# EAGLE design B171X (EAGLE 6.6.0)
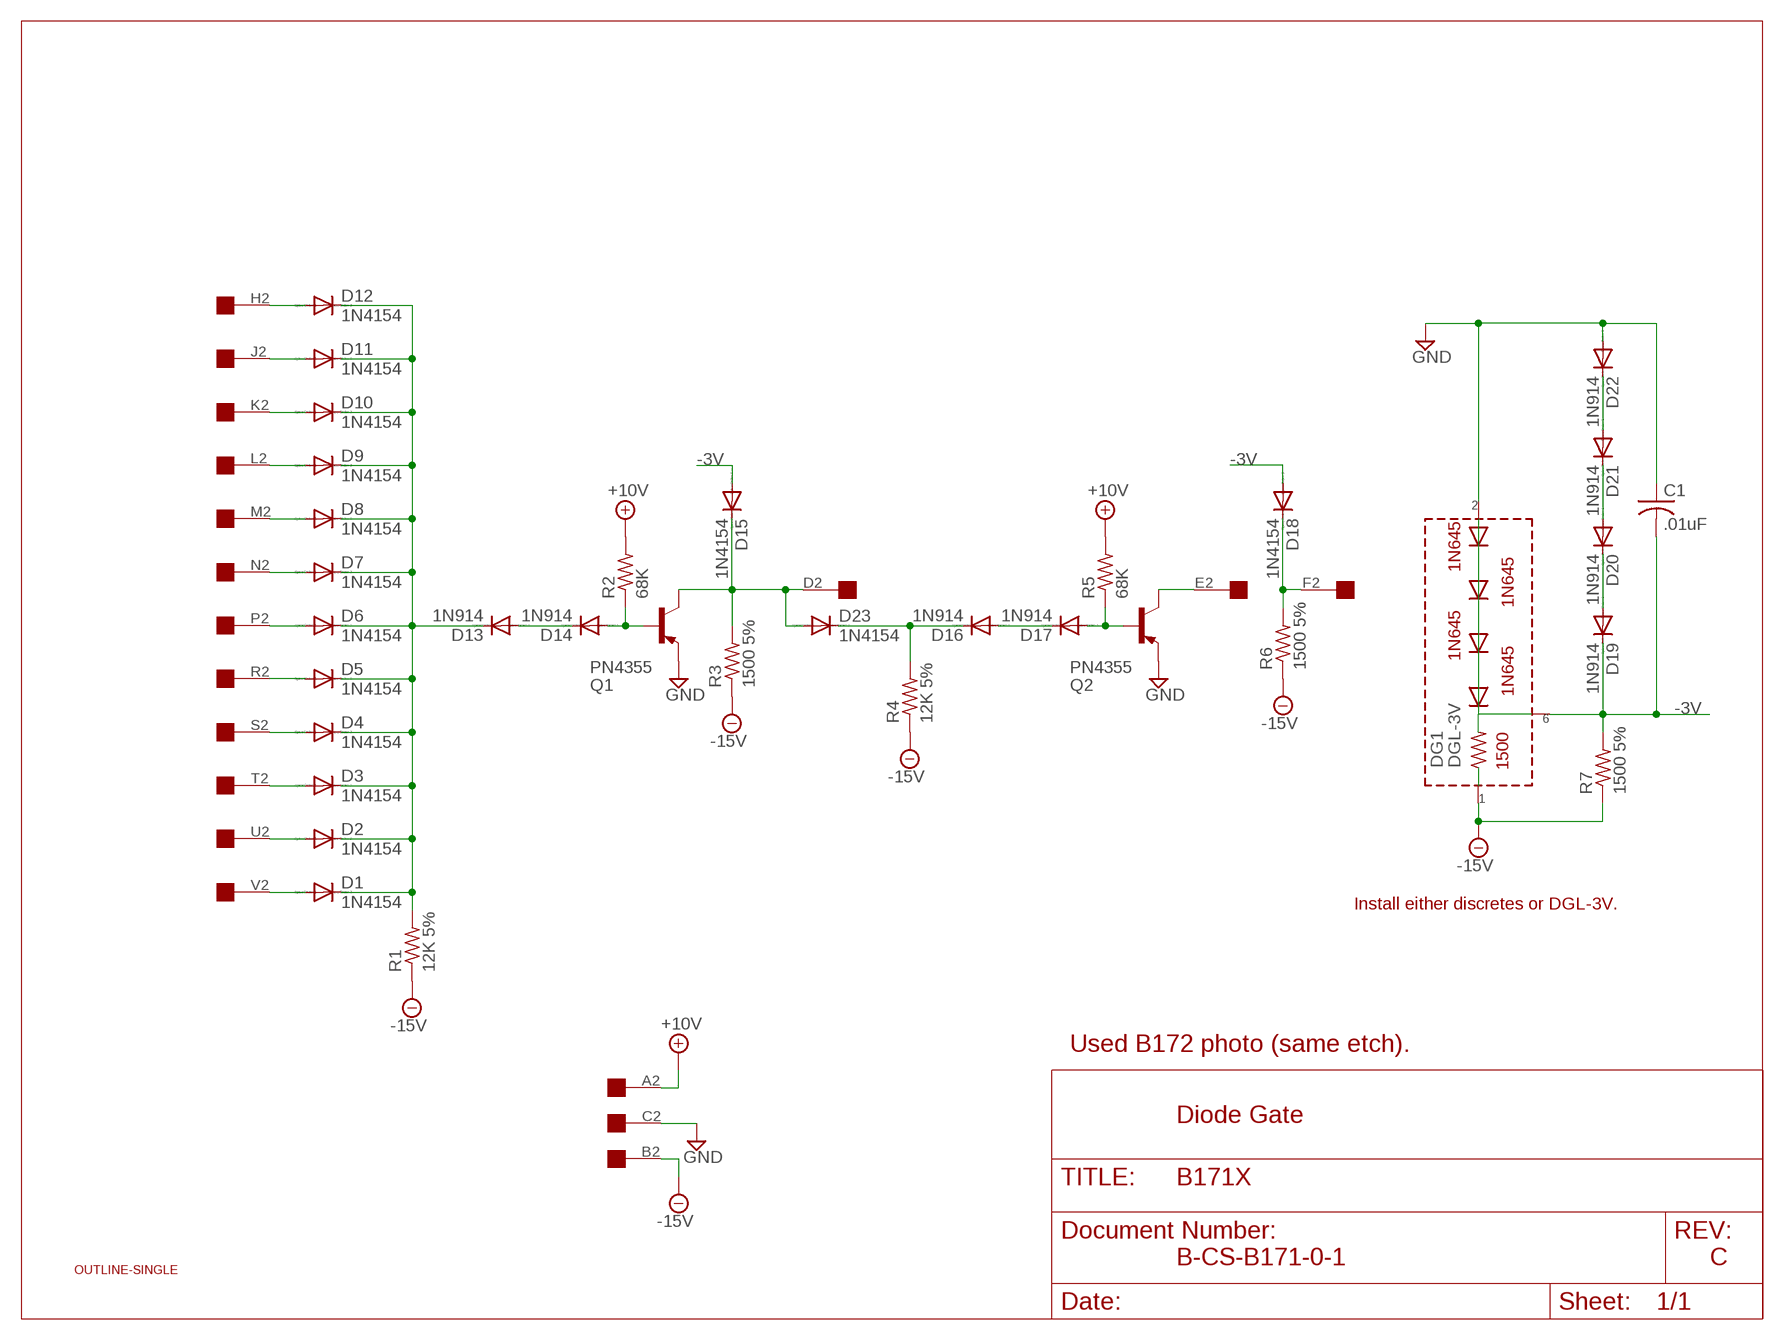
[diagram p0: schematic, sheet 1]

## Parts
C1  .01uF  C-US050-025X075  [C050-025X075]
D1  1N4154  DIODE-DO35-10  [DO35-10]
D2  1N4154  DIODE-DO35-10  [DO35-10]
D3  1N4154  DIODE-DO35-10  [DO35-10]
D4  1N4154  DIODE-DO35-10  [DO35-10]
D5  1N4154  DIODE-DO35-10  [DO35-10]
D6  1N4154  DIODE-DO35-10  [DO35-10]
D7  1N4154  DIODE-DO35-10  [DO35-10]
D8  1N4154  DIODE-DO35-10  [DO35-10]
D9  1N4154  DIODE-DO35-10  [DO35-10]
D10  1N4154  DIODE-DO35-10  [DO35-10]
D11  1N4154  DIODE-DO35-10  [DO35-10]
D12  1N4154  DIODE-DO35-10  [DO35-10]
D13  1N914  DIODE-DO35-10  [DO35-10]
D14  1N914  DIODE-DO35-10  [DO35-10]
D15  1N4154  DIODE-DO35-10  [DO35-10]
D16  1N914  DIODE-DO35-10  [DO35-10]
D17  1N914  DIODE-DO35-10  [DO35-10]
D18  1N4154  DIODE-DO35-10  [DO35-10]
D19  1N914  DIODE-DO35-10  [DO35-10]
D20  1N914  DIODE-DO35-10  [DO35-10]
D21  1N914  DIODE-DO35-10  [DO35-10]
D22  1N914  DIODE-DO35-10  [DO35-10]
D23  1N4154  DIODE-DO35-10  [DO35-10]
DG1  DGL-3V  [DGL2]
Q1  PN4355  -PNP-TO5  [TO5]
Q2  PN4355  -PNP-TO5  [TO5]
R1  12K 5%  R-US_0207/10  [0207/10]
R2  68K  R-US_0207/10  [0207/10]
R3  1500 5%  R-US_0207/10  [0207/10]
R4  12K 5%  R-US_0207/10  [0207/10]
R5  68K  R-US_0207/10  [0207/10]
R6  1500 5%  R-US_0207/10  [0207/10]
R7  1500 5%  R-US_0207/10  [0207/10]
U$1  OUTLINE-SINGLE  [SINGLE]
U$2  EDGE-1  [EDGE-CON1]

## Nets
+10V: R2.2 R5.2 U$2.A2
-3V: C1.2 D15.A D18.A D19.C DG1.P$6 R7.2
-15V: DG1.P$1 R1.1 R3.1 R4.1 R6.1 R7.1 U$2.B2
D: D15.C D23.A Q1.3(C) R3.2 U$2.D2
E: Q2.3(C) U$2.E2
GND: C1.1 D22.A DG1.P$2 Q1.1(E) Q2.1(E) U$2.C2
H: D12.A U$2.H2
J: D11.A U$2.J2
K: D10.A U$2.K2
L: D9.A U$2.L2
M: D8.A U$2.M2
N: D7.A U$2.N2
N$1: D1.C D2.C D3.C D4.C D5.C D6.C D7.C D8.C D9.C D10.C D11.C D12.C D13.C R1.2
N$2: D13.A D14.C
N$3: D14.A Q1.2(B) R2.1
N$4: D16.C D23.C R4.2
N$5: D16.A D17.C
N$6: D17.A Q2.2(B) R5.1
N$7: D18.C R6.2 U$2.F2
N$10: D19.A D20.C
N$11: D20.A D21.C
N$12: D21.A D22.C
P: D6.A U$2.P2
R: D5.A U$2.R2
S: D4.A U$2.S2
T: D3.A U$2.T2
U: D2.A U$2.U2
V: D1.A U$2.V2

## Notes on the sheet
- Install either discretes or DGL-3V.
- Used B172 photo (same etch).
- Diode Gate
- B-CS-B171-0-1 | C

## Library data of the parts
C1 = rcl:C-US: CAPACITOR, American symbol
D1-D23 = diode:DIODE-: DIODE
DG1 = dec-con:DGL-3V: -3V Clamp/Reference
Q1 Q2 = transistor:*-PNP-: PNP Transistror
R1-R7 = rcl:R-US_: RESISTOR, American symbol
U$1 = dec-con:OUTLINE-*: Board outlines for DEC boards.
U$2 = dec-con:EDGE-1: Single-Sided DEC Edge Connector -- (side 2)

## Net classes
0 default: width 0.813 mm

## Board
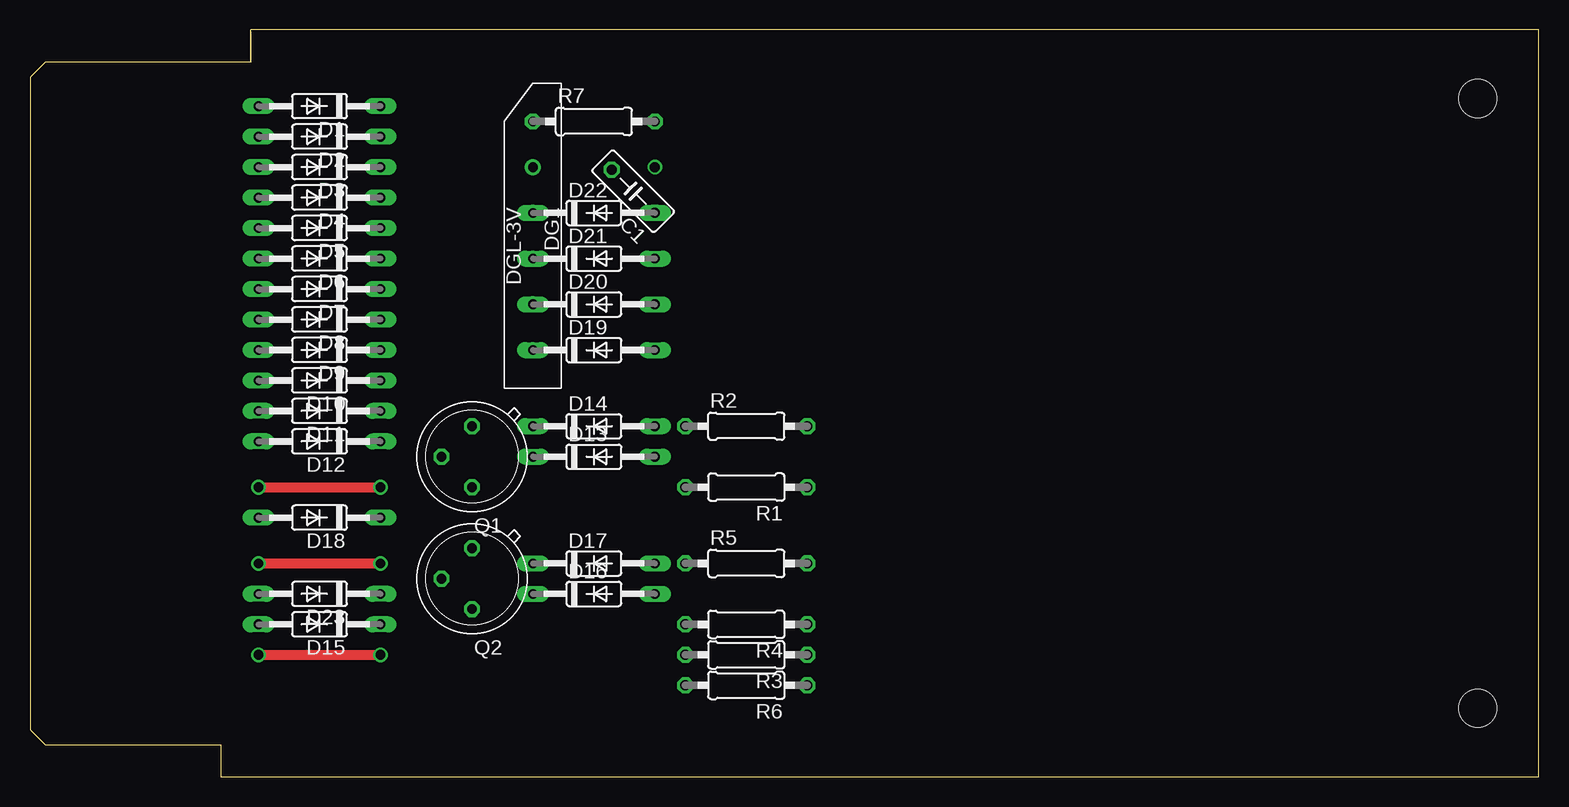
[diagram p1: board, top side]
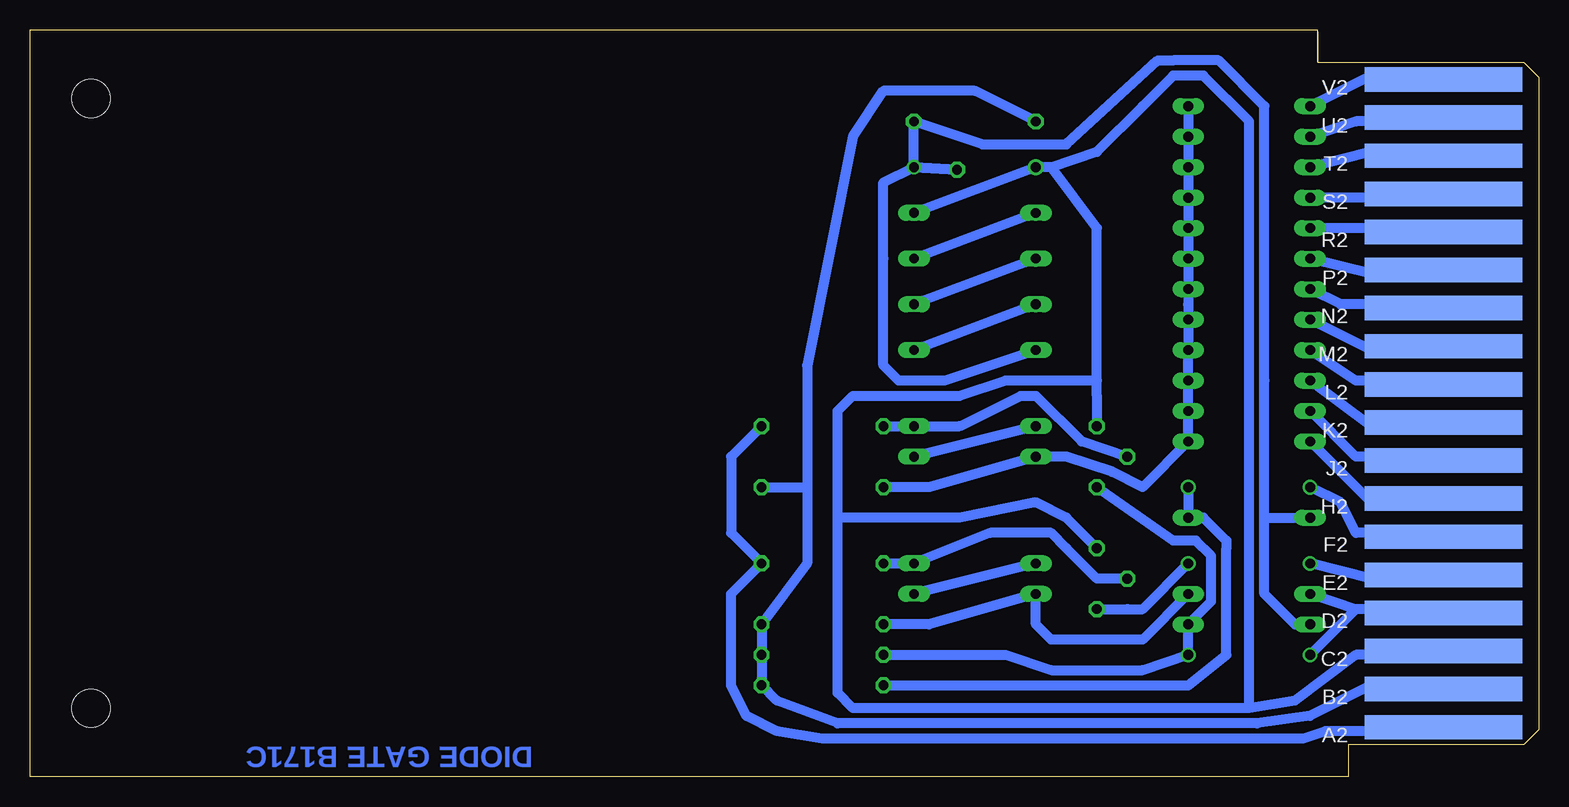
[diagram p2: board, bottom side, seen from below]

Size 125.73 x 62.23 mm. Coordinates in mm from the lower left corner, seen from the top.
Copper layers (1+16): Top 0.035mm / dielectric 1.5mm / Bottom 0.035mm
Design rules "16mils": minimum track width 16mil, minimum drill 32mil, track to track 15mil, track to pad 10mil, pad to pad 10mil, via to via 10mil, smd to smd 10mil, copper to edge 13mil, drill to drill 10mil, minimum pad ring 10mil, minimum via ring 8mil, stop-mask expansion 0mil, vias tented up to drill 0mil, thermal gap 10mil

### Footprints (pad centres in the part's own frame; a part is rotated, then mirrored left to right if it is on the bottom)
C050-025X075 = drill 0.813 octagon: 1 -2.54,0; 2 2.54,0
DO35-10 = drill 0.813 long: A 5.08,0; C -5.08,0
DGL2 = drill 0.813: P$1 -9.525,0; P$2 -5.715,0; P$3 -1.905,0; P$4 1.905,0; P$5 5.715,0; P$6 9.525,0
TO5 = drill 0.813 octagon: 1 0,-2.54; 2 2.54,0; 3 0,2.54
0207/10 = drill 0.813 octagon: 1 -5.08,0; 2 5.08,0
SINGLE = hole 3.175: 120.65,56.515; 120.65,5.715
EDGE-CON1 = smd 13.106 x 2.032 bottom: A2 7.938,4.128; B2 7.938,7.303; C2 7.938,10.477; D2 7.938,13.652; E2 7.938,16.828; F2 7.938,20.003; H2 7.938,23.177; J2 7.938,26.352; K2 7.938,29.527; L2 7.938,32.703; M2 7.938,35.877; N2 7.938,39.053; P2 7.938,42.227; R2 7.938,45.403; S2 7.938,48.578; T2 7.938,51.752; U2 7.938,54.928; V2 7.938,58.102

### Placement (x,y rotation side)
C1  50.27,48.79 135 top
D1  24.13,55.88 180 top
D2  24.13,53.34 180 top
D3  24.13,50.8 180 top
D4  24.13,48.26 180 top
D5  24.13,45.72 180 top
D6  24.13,43.18 180 top
D7  24.13,40.64 180 top
D8  24.13,38.1 180 top
D9  24.13,35.56 180 top
D10  24.13,33.02 180 top
D11  24.13,30.48 180 top
D12  24.13,27.94 180 top
D13  46.99,26.67 0 top
D14  46.99,29.21 0 top
D15  24.13,12.7 180 top
D16  46.99,15.24 0 top
D17  46.99,17.78 0 top
D18  24.13,21.59 180 top
D19  46.99,35.56 0 top
D20  46.99,39.37 0 top
D21  46.99,43.18 0 top
D22  46.99,46.99 0 top
D23  24.13,15.24 180 top
DG1  41.91,45.09 270 top
Q1  36.83,26.67 180 top
Q2  36.83,16.51 180 top
R1  59.69,24.13 180 top
R2  59.69,29.21 0 top
R3  59.69,10.16 180 top
R4  59.69,12.7 180 top
R5  59.69,17.78 0 top
R6  59.69,7.62 180 top
R7  46.99,54.61 0 top
U$1  0,0 0 top
U$2  0,0 0 top

### Tracks (layer width: path | path; a pad name or v marks a point on that pad's centre or on a via)
+10V
  Bottom 0.813: U$2.A2 11.43,3.81 17.78,3.81 19.69,3.17 31.75,3.17 59.69,3.17 63.5,3.81 66.04,5.08 67.31,7.62 67.31,15.24 R5.2 67.31,20.32 67.31,26.67 R2.2
-3V  (via drill 0.81)
  Bottom 0.813: D15.A 20.32,12.7 22.86,15.24 22.86,21.59 | 22.86,21.59 D18.A | 22.86,21.59 22.86,33.02 22.86,55.88 26.67,59.69 30.48,59.69 31.75,59.69 39.37,52.7 46.36,52.7 R7.2 v52.07,50.8 | C1.2 v52.07,50.8 | D19.C 49.53,33.02 53.34,33.02 54.61,34.29 54.61,43.18 54.61,49.53 v52.07,50.8 | v52.07,50.8 C1.2 | C1.2 v52.07,50.8
-15V
  Bottom 0.813: U$2.B2 7.62,7.62 13.97,7.62 19.05,5.08 23.5,4.45 58.42,4.45 63.5,6.35 R6.1 R3.1 R4.1 60.96,17.78 60.96,24.13 | R7.1 46.99,57.15 54.61,57.15 57.15,53.34 60.96,34.29 60.96,24.13 | R1.1 60.96,24.13
D  (via drill 0.81)
  Top 0.813: v19.05,10.16 v29.21,10.16
  Bottom 0.813: R3.2 44.45,10.16 40.64,8.89 33.02,8.89 v29.21,10.16 D15.C 27.31,14.61 27.31,18.41 28.58,19.68 30.48,19.68 Q1.3 | U$2.D2 8.89,13.97 15.24,13.97 | 15.24,13.97 D23.A | 15.24,13.97 v19.05,10.16
E  (via drill 0.81)
  Top 0.813: v19.05,17.78 v29.21,17.78
  Bottom 0.813: U$2.E2 8.89,16.51 13.97,16.51 v19.05,17.78 | Q2.3 34.29,13.97 33.02,13.97 v29.21,17.78
GND
  Bottom 0.813: U$2.C2 8.89,10.16 13.97,10.16 15.24,10.16 20.32,6.35 24.13,5.71 | 24.13,5.71 24.13,17.78 24.13,54.61 27.94,58.42 30.48,58.42 33.02,55.88 36.83,52.07 40.64,50.8 | 24.13,5.71 57.15,5.71 58.42,6.99 58.42,12.7 58.42,21.59 | 58.42,21.59 58.42,30.48 57.15,31.75 48.26,31.75 44.45,33.02 36.83,33.02 | 58.42,21.59 48.26,21.59 41.91,22.86 39.37,21.59 Q2.1 | 36.83,33.02 36.83,31.75 Q1.1 | 36.83,33.02 36.83,45.72 40.64,50.8 | 40.64,50.8 DG1.P$2 C1.1 D22.A
H
  Bottom 0.813: U$2.H2 8.89,22.86 13.97,22.86 D12.A
J
  Bottom 0.813: U$2.J2 8.89,26.67 15.24,26.67 D11.A
K
  Bottom 0.813: U$2.K2 8.89,29.21 13.97,29.21 D10.A
L
  Bottom 0.813: U$2.L2 8.89,33.02 15.24,33.02 D9.A
M
  Bottom 0.813: U$2.M2 8.89,35.56 13.97,35.56 D8.A
N
  Bottom 0.813: U$2.N2 8.89,39.37 16.51,39.37 D7.A
N$1
  Bottom 0.813: D1.C D2.C D3.C D4.C D5.C D6.C D7.C 29.21,39.37 D8.C D9.C D10.C D11.C D12.C 33.02,24.13 35.56,25.4 39.37,26.67 D13.C 50.8,24.13 R1.2
N$2
  Bottom 0.813: D14.C D13.A
N$3
  Bottom 0.813: R2.1 D14.A 48.26,29.21 43.18,31.75 41.91,31.75 38.1,27.94 Q1.2
N$4
  Bottom 0.813: R4.2 50.8,12.7 D16.C 41.91,12.7 40.64,11.43 39.37,11.43 34.29,11.43 33.02,11.43 D23.C
N$5
  Bottom 0.813: D17.C D16.A
N$6
  Bottom 0.813: R5.1 D17.A 45.72,20.32 40.64,20.32 39.37,19.05 36.83,16.51 Q2.2
N$7  (via drill 0.81)
  Top 0.813: v19.05,24.13 v29.21,24.13
  Bottom 0.813: U$2.F2 8.89,20.32 15.24,20.32 16.51,22.86 v19.05,24.13 | v29.21,24.13 D18.C 27.94,21.59 26.04,19.68 26.04,19.05 26.04,10.16 29.21,7.62 30.48,7.62 45.72,7.62 R6.2
N$10
  Bottom 0.813: D20.C D19.A
N$11
  Bottom 0.813: D21.C D20.A
N$12
  Bottom 0.813: D22.C D21.A
P
  Bottom 0.813: U$2.P2 8.57,42.23 8.89,41.91 13.97,41.91 D6.A
R
  Bottom 0.813: U$2.R2 8.57,45.4 8.89,45.72 D5.A
S
  Bottom 0.813: U$2.S2 8.57,48.58 8.89,48.26 D4.A
T
  Bottom 0.813: U$2.T2 8.57,51.75 8.89,52.07 13.97,52.07 D3.A
U
  Bottom 0.813: U$2.U2 8.57,54.93 8.89,54.61 15.24,54.61 D2.A
V
  Bottom 0.813: U$2.V2 8.89,58.1 8.89,58.42 13.97,58.42 D1.A

### Text on the board
Bottom: DIODE GATE B171C